# Altium schematic sheet IMU.SchDoc
size A4; SheetNumber: 4; SheetTotal: 4
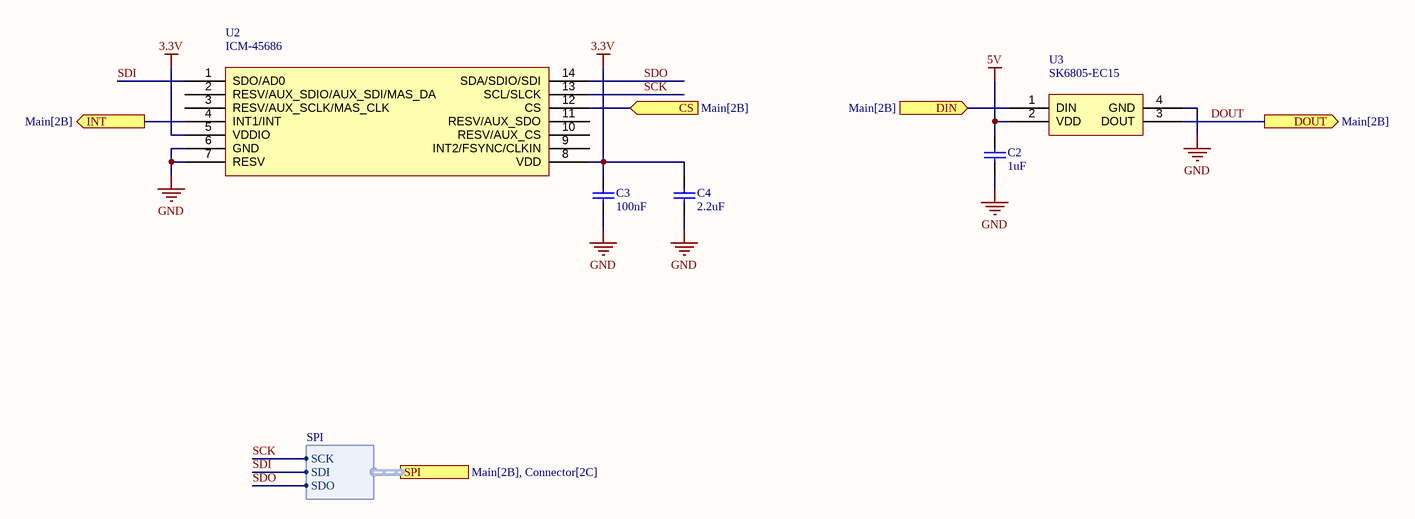
[diagram p0: IMU.SchDoc]

## Parts
C2  1uF  [Capacitor 0201]
C3  100nF  [Capacitor 0201]
C4  2.2uF  [Capacitor 0201]
U2  ICM-45686  [ICM-45686]
U3  SK6805-EC15  [SK6805-EC15]

## Ports
CS (in, see Main[2B]), DIN (in, see Main[2B]), DOUT (out, see Main[2B]), INT (out, see Main[2B]), SPI (harness SPI, see Main[2B], Connector[2C])

## Harnesses
SPI: SCK, SDI, SDO

## Nets
3.3V: C3.2 C4.2 U2.5(VDDIO) U2.8(VDD)
5V: C2.2 U3.2(VDD)
GND: C2.1 C3.1 C4.1 U2.6(GND) U2.7(RESV) U3.4(GND)
CS: U2.12(CS) ; port CS
DIN: U3.1(DIN) ; port DIN
DOUT: U3.3(DOUT) ; port DOUT
INT: U2.4(INT1/INT) ; port INT
SCK: U2.13(SCL/SLCK) ; port SPI.SCK
SDI: U2.1(SDO/AD0) ; port SPI.SDI
SDO: U2.14(SDA/SDIO/SDI) ; port SPI.SDO

Not connected (* = marked no-connect by the designer): U2 2(RESV/AUX_SDIO/AUX_SDI/MAS_DA) 3(RESV/AUX_SCLK/MAS_CLK) 9(INT2/FSYNC/CLKIN) 10(RESV/AUX_CS) 11(RESV/AUX_SDO)

## Notes on the sheet
- TITLE
- SIZE
- A4
- VARIANT
- PROJECT
- SHEET
- VERSION
- OF
- AUTHOR
- DATE

## Library data of the parts
C2-C4 = Capacitor